# Altium schematic sheet SDRAM.SchDoc
size A3; Company Name: Renesas Electronics America; CompanyURL: www.renesas.com; PageSetup: Record=PageOptions|CenterHorizontal=True|CenterVertical=True|PrintScale=1.00|XCorrection=1.00|YCorrection=1.00|PrintKind=1|BorderSize=5000000|LeftOffset=0|BottomOffset=0|Orientation=2|PaperLength=1000|PaperWidth=1000|Scale=100|PaperSource=7|PrintQuality=-4|MediaType=1|DitherType=10|PaperKind=A5 148x210mm|PrintScaleMode=1; ReleaseDate: 16.09.2025; Version: MP; SheetNumber: 17; SheetTotal: 18; VariantNumber: 0; DSheetNumber: 1
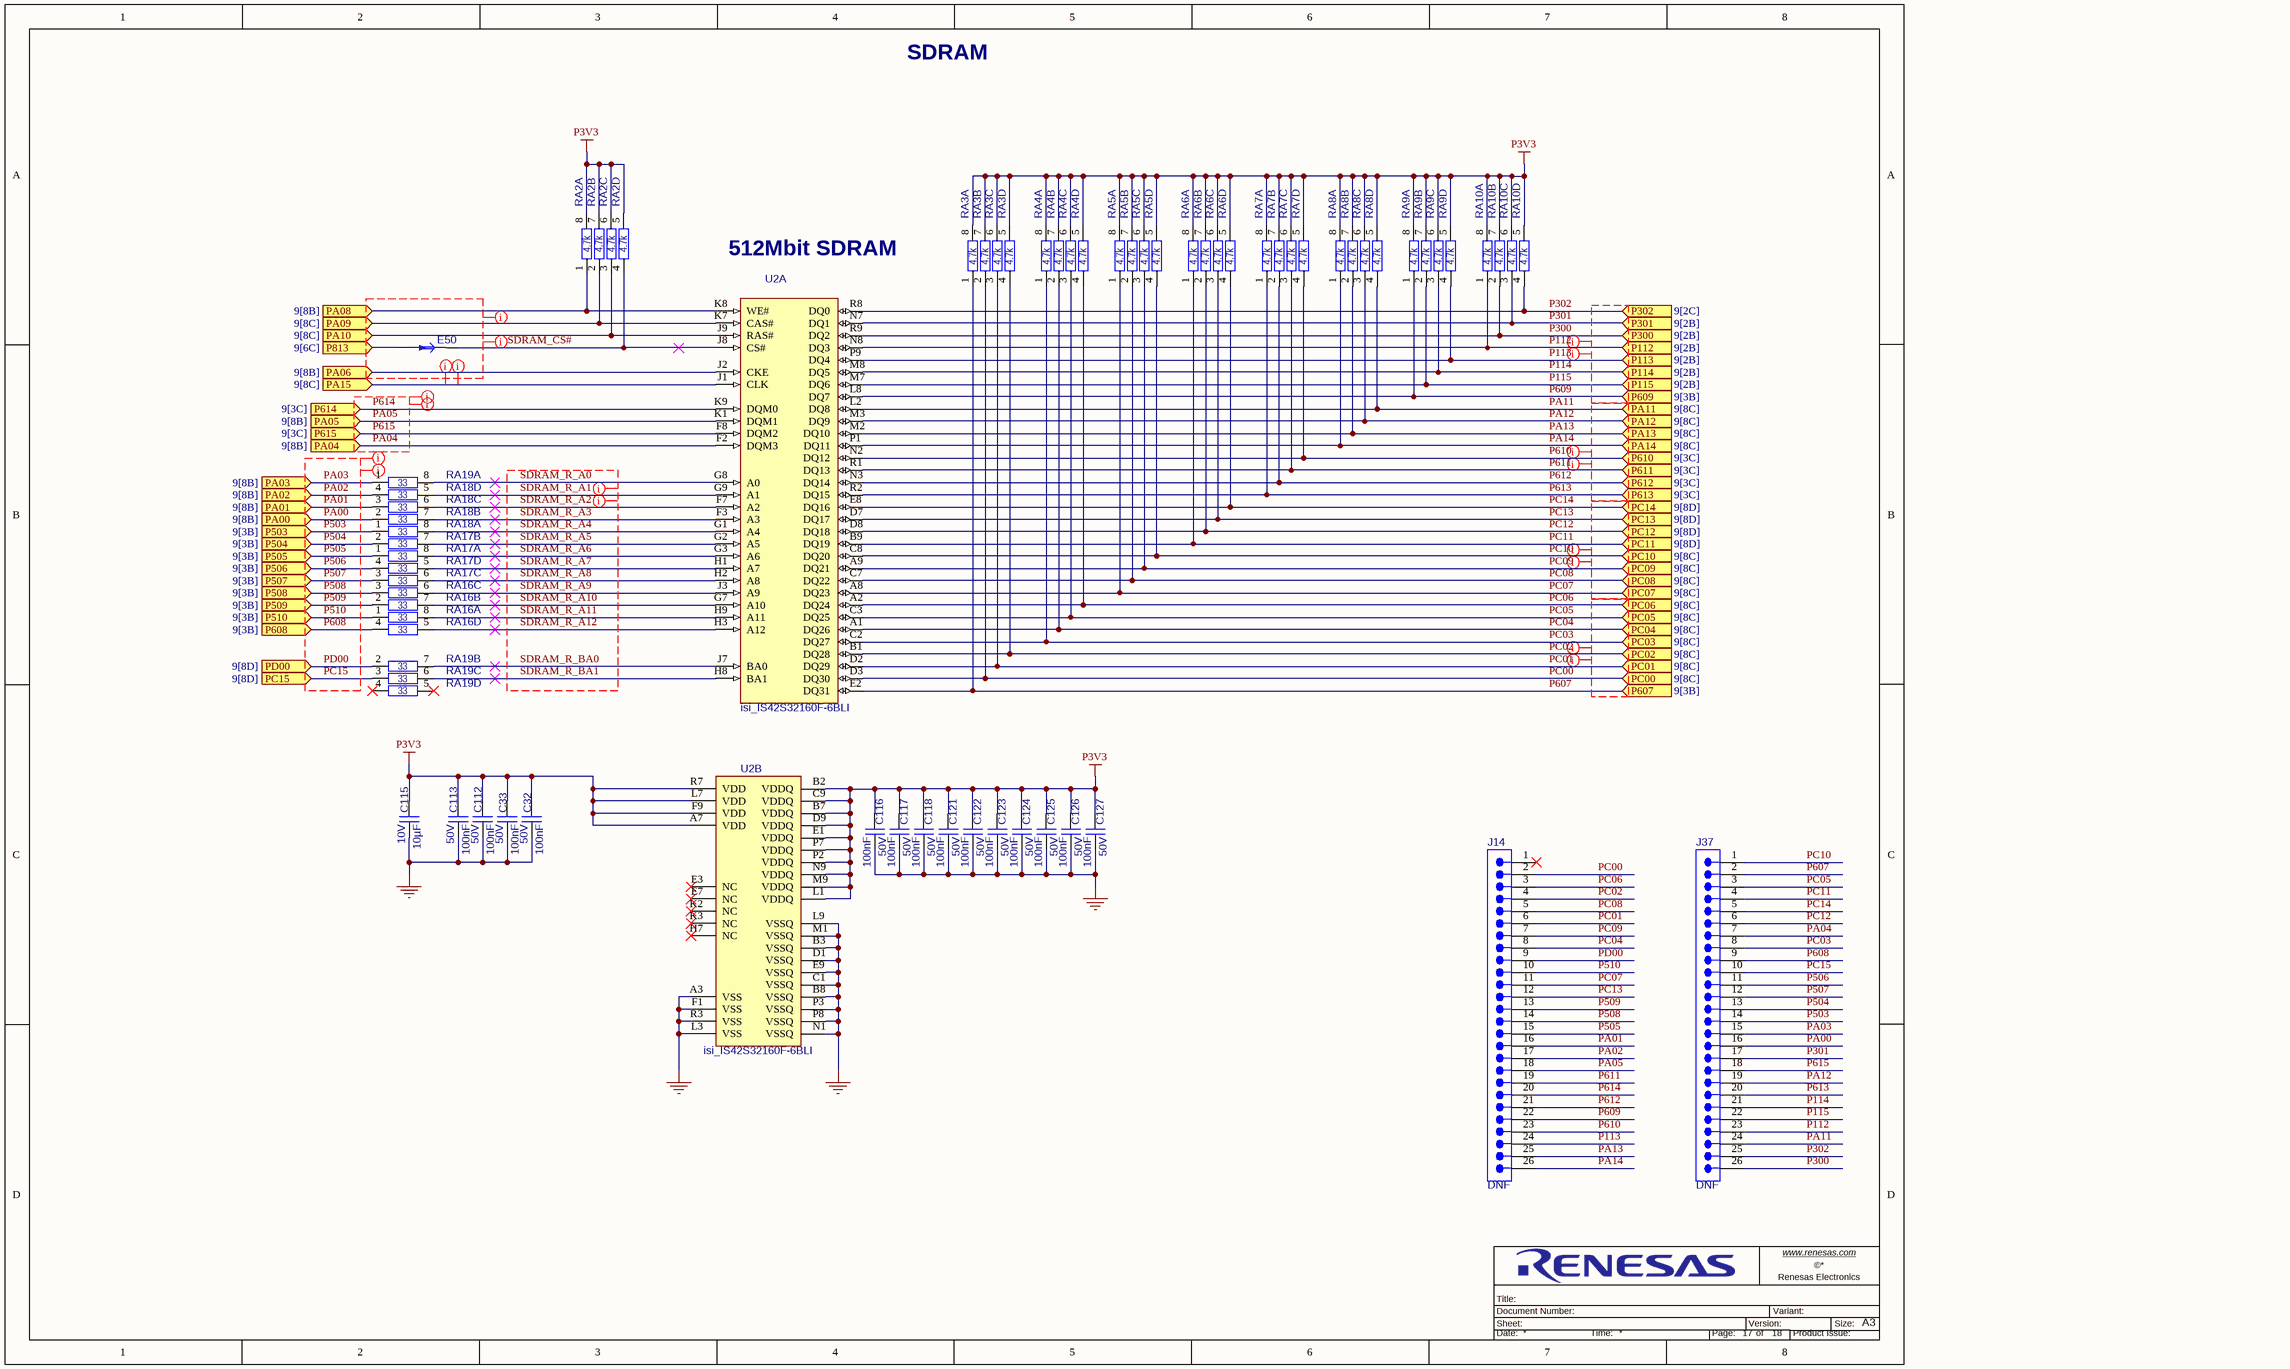
[diagram p0: SDRAM.SchDoc]

## Parts
C32  value 100nF  Operating Voltage Max: 50V  [C_EIA0402_0p55]  (hidden comment: Capacitor)
C33  value 100nF  Operating Voltage Max: 50V  [C_EIA0402_0p55]  (hidden comment: Capacitor)
C112  value 100nF  Operating Voltage Max: 50V  [C_EIA0402_0p55]  (hidden comment: Capacitor)
C113  value 100nF  Operating Voltage Max: 50V  [C_EIA0402_0p55]  (hidden comment: Capacitor)
C115  value 10µF  Operating Voltage Max: 10V  [C_EIA0402_0p7]  (hidden comment: Capacitor)
C116  value 100nF  Operating Voltage Max: 50V  [C_EIA0402_0p55]  (hidden comment: Capacitor)
C117  value 100nF  Operating Voltage Max: 50V  [C_EIA0402_0p55]  (hidden comment: Capacitor)
C118  value 100nF  Operating Voltage Max: 50V  [C_EIA0402_0p55]  (hidden comment: Capacitor)
C121  value 100nF  Operating Voltage Max: 50V  [C_EIA0402_0p55]  (hidden comment: Capacitor)
C122  value 100nF  Operating Voltage Max: 50V  [C_EIA0402_0p55]  (hidden comment: Capacitor)
C123  value 100nF  Operating Voltage Max: 50V  [C_EIA0402_0p55]  (hidden comment: Capacitor)
C124  value 100nF  Operating Voltage Max: 50V  [C_EIA0402_0p55]  (hidden comment: Capacitor)
C125  value 100nF  Operating Voltage Max: 50V  [C_EIA0402_0p55]  (hidden comment: Capacitor)
C126  value 100nF  Operating Voltage Max: 50V  [C_EIA0402_0p55]  (hidden comment: Capacitor)
C127  value 100nF  Operating Voltage Max: 50V  [C_EIA0402_0p55]  (hidden comment: Capacitor)
E50  TRACE_CUT_0805  [trace_cut_0805]  (value not drawn)  (net tie, no BOM)
J14  NRPN132PAEN-RC  [sul_NRPN132PAEN-RC]  (value not drawn)
J37  NRPN132PAEN-RC  [sul_NRPN132PAEN-RC]  (value not drawn)
RA2  value 4.7k  [R_Array_EIA0804]  (hidden comment: YC124-FR-074K7L)  (parts A,B,C,D of 4)
RA3  value 4.7k  [R_Array_EIA0804]  (hidden comment: Resistor_Array)  (parts A,B,C,D of 4)
RA4  value 4.7k  [R_Array_EIA0804]  (hidden comment: Resistor_Array)  (parts A,B,C,D of 4)
RA5  value 4.7k  [R_Array_EIA0804]  (hidden comment: Resistor_Array)  (parts A,B,C,D of 4)
RA6  value 4.7k  [R_Array_EIA0804]  (hidden comment: Resistor_Array)  (parts A,B,C,D of 4)
RA7  value 4.7k  [R_Array_EIA0804]  (hidden comment: Resistor_Array)  (parts A,B,C,D of 4)
RA8  value 4.7k  [R_Array_EIA0804]  (hidden comment: Resistor_Array)  (parts A,B,C,D of 4)
RA9  value 4.7k  [R_Array_EIA0804]  (hidden comment: Resistor_Array)  (parts A,B,C,D of 4)
RA10  value 4.7k  [R_Array_EIA0804]  (hidden comment: Resistor_Array)  (parts A,B,C,D of 4)
RA16  value 33  [R_Array_EIA0804]  (hidden comment: Resistor_Array)  (parts A,B,C,D of 4)
RA17  value 33  [R_Array_EIA0804]  (hidden comment: Resistor_Array)  (parts A,B,C,D of 4)
RA18  value 33  [R_Array_EIA0804]  (hidden comment: Resistor_Array)  (parts A,B,C,D of 4)
RA19  value 33  [R_Array_EIA0804]  (hidden comment: Resistor_Array)  (parts A,B,C,D of 4)
U2  isi_IS42S32160F-6BLI  [isi_TF-BGA-90_8x13mm]  (parts A,B of 2)

## Ports
P112 (in, see 9[2B]), P113 (in, see 9[2B]), P114 (in, see 9[2B]), P115 (in, see 9[2B]), P300 (in, see 9[2B]), P301 (in, see 9[2B]), P302 (in, see 9[2C]), P503 (in, see 9[3B]), P504 (in, see 9[3B]), P505 (in, see 9[3B]), P506 (in, see 9[3B]), P507 (in, see 9[3B]), P508 (in, see 9[3B]), P509 (in, see 9[3B]), P510 (in, see 9[3B]), P607 (in, see 9[3B]), P608 (in, see 9[3B]), P609 (in, see 9[3B]), P610 (in, see 9[3C]), P611 (in, see 9[3C]), P612 (in, see 9[3C]), P613 (in, see 9[3C]), P614 (in, see 9[3C]), P615 (in, see 9[3C]), P813 (in, see 9[6C]), PA00 (in, see 9[8B]), PA01 (in, see 9[8B]), PA02 (in, see 9[8B]), PA03 (in, see 9[8B]), PA04 (in, see 9[8B]), PA05 (in, see 9[8B]), PA06 (in, see 9[8B]), PA08 (in, see 9[8B]), PA09 (in, see 9[8C]), PA10 (in, see 9[8C]), PA11 (in, see 9[8C]), PA12 (in, see 9[8C]), PA13 (in, see 9[8C]), PA14 (in, see 9[8C]), PA15 (in, see 9[8C]), PC00 (in, see 9[8C]), PC01 (in, see 9[8C]), PC02 (in, see 9[8C]), PC03 (in, see 9[8C]), PC04 (in, see 9[8C]), PC05 (in, see 9[8C]), PC06 (in, see 9[8C]), PC07 (in, see 9[8C]), PC08 (in, see 9[8C]), PC09 (in, see 9[8C]), PC10 (in, see 9[8C]), PC11 (in, see 9[8D]), PC12 (in, see 9[8D]), PC13 (in, see 9[8D]), PC14 (in, see 9[8D]), PC15 (in, see 9[8D]), PD00 (in, see 9[8D])

## Nets
GND: C32.2 C33.2 C112.2 C113.2 C115.2 C116.2 C117.2 C118.2 C121.2 C122.2 C123.2 C124.2 C125.2 C126.2 C127.2 U2.A3(VSS) U2.B3(VSSQ) U2.B8(VSSQ) U2.C1(VSSQ) U2.D1(VSSQ) U2.E9(VSSQ) U2.F1(VSS) U2.L3(VSS) U2.L9(VSSQ) U2.M1(VSSQ) U2.N1(VSSQ) U2.P3(VSSQ) U2.P8(VSSQ) U2.R3(VSS)
P3V3: C32.1 C33.1 C112.1 C113.1 C115.1 C116.1 C117.1 C118.1 C121.1 C122.1 C123.1 C124.1 C125.1 C126.1 C127.1 RA2.5 RA2.6 RA2.7 RA2.8 RA3.5 RA3.6 RA3.7 RA3.8 RA4.5 RA4.6 RA4.7 RA4.8 RA5.5 RA5.6 RA5.7 RA5.8 RA6.5 RA6.6 RA6.7 RA6.8 RA7.5 RA7.6 RA7.7 RA7.8 RA8.5 RA8.6 RA8.7 RA8.8 RA9.5 RA9.6 RA9.7 RA9.8 RA10.5 RA10.6 RA10.7 RA10.8 U2.A7(VDD) U2.B2(VDDQ) U2.B7(VDDQ) U2.C9(VDDQ) U2.D9(VDDQ) U2.E1(VDDQ) U2.F9(VDD) U2.L1(VDDQ) U2.L7(VDD) U2.M9(VDDQ) U2.N9(VDDQ) U2.P2(VDDQ) U2.P7(VDDQ) U2.R7(VDD)
P112: J37.23 RA10.1 U2.N8(DQ3) ; port P112
P113: J14.24 RA9.4 U2.P9(DQ4) ; port P113
P114: J37.21 RA9.3 U2.M8(DQ5) ; port P114
P115: J37.22 RA9.2 U2.M7(DQ6) ; port P115
P300: J37.26 RA10.2 U2.R9(DQ2) ; port P300
P301: J37.17 RA10.3 U2.N7(DQ1) ; port P301
P302: J37.25 RA10.4 U2.R8(DQ0) ; port P302
P503: J37.14 RA18.1 ; port P503
P504: J37.13 RA17.2 ; port P504
P505: J14.15 RA17.1 ; port P505
P506: J37.11 RA17.4 ; port P506
P507: J37.12 RA17.3 ; port P507
P508: J14.14 RA16.3 ; port P508
P509: J14.13 RA16.2 ; port P509
P510: J14.10 RA16.1 ; port P510
P607: J37.2 RA3.1 U2.E2(DQ31) ; port P607
P608: J37.9 RA16.4 ; port P608
P609: J14.22 RA9.1 U2.L8(DQ7) ; port P609
P610: J14.23 RA7.4 U2.N2(DQ12) ; port P610
P611: J14.19 RA7.3 U2.R1(DQ13) ; port P611
P612: J14.21 RA7.2 U2.N3(DQ14) ; port P612
P613: J37.20 RA7.1 U2.R2(DQ15) ; port P613
P614: J14.20 U2.K9(DQM0) ; port P614
P615: J37.18 U2.F8(DQM2) ; port P615
P813: E50.2 ; port P813
PA00: J37.16 RA18.2 ; port PA00
PA01: J14.16 RA18.3 ; port PA01
PA02: J14.17 RA18.4 ; port PA02
PA03: J37.15 RA19.1 ; port PA03
PA04: J37.7 U2.F2(DQM3) ; port PA04
PA05: J14.18 U2.K1(DQM1) ; port PA05
PA06: U2.J2(CKE) ; port PA06
PA08: RA2.1 U2.K8(WE#) ; port PA08
PA09: RA2.2 U2.K7(CAS#) ; port PA09
PA10: RA2.3 U2.J9(RAS#) ; port PA10
PA11: J37.24 RA8.4 U2.L2(DQ8) ; port PA11
PA12: J37.19 RA8.3 U2.M3(DQ9) ; port PA12
PA13: J14.25 RA8.2 U2.M2(DQ10) ; port PA13
PA14: J14.26 RA8.1 U2.P1(DQ11) ; port PA14
PA15: U2.J1(CLK) ; port PA15
PC00: J14.2 RA3.2 U2.D3(DQ30) ; port PC00
PC01: J14.6 RA3.3 U2.D2(DQ29) ; port PC01
PC02: J14.4 RA3.4 U2.B1(DQ28) ; port PC02
PC03: J37.8 RA4.1 U2.C2(DQ27) ; port PC03
PC04: J14.8 RA4.2 U2.A1(DQ26) ; port PC04
PC05: J37.3 RA4.3 U2.C3(DQ25) ; port PC05
PC06: J14.3 RA4.4 U2.A2(DQ24) ; port PC06
PC07: J14.11 RA5.1 U2.A8(DQ23) ; port PC07
PC08: J14.5 RA5.2 U2.C7(DQ22) ; port PC08
PC09: J14.7 RA5.3 U2.A9(DQ21) ; port PC09
PC10: J37.1 RA5.4 U2.C8(DQ20) ; port PC10
PC11: J37.4 RA6.1 U2.B9(DQ19) ; port PC11
PC12: J37.6 RA6.2 U2.D8(DQ18) ; port PC12
PC13: J14.12 RA6.3 U2.D7(DQ17) ; port PC13
PC14: J37.5 RA6.4 U2.E8(DQ16) ; port PC14
PC15: J37.10 RA19.3 ; port PC15
PD00: J14.9 RA19.2 ; port PD00
SDRAM_CS#: E50.1 RA2.4 U2.J8(CS#)
SDRAM_R_A0: RA19.8 U2.G8(A0)
SDRAM_R_A1: RA18.5 U2.G9(A1)
SDRAM_R_A2: RA18.6 U2.F7(A2)
SDRAM_R_A3: RA18.7 U2.F3(A3)
SDRAM_R_A4: RA18.8 U2.G1(A4)
SDRAM_R_A5: RA17.7 U2.G2(A5)
SDRAM_R_A6: RA17.8 U2.G3(A6)
SDRAM_R_A7: RA17.5 U2.H1(A7)
SDRAM_R_A8: RA17.6 U2.H2(A8)
SDRAM_R_A9: RA16.6 U2.J3(A9)
SDRAM_R_A10: RA16.7 U2.G7(A10)
SDRAM_R_A11: RA16.8 U2.H9(A11)
SDRAM_R_A12: RA16.5 U2.H3(A12)
SDRAM_R_BA0: RA19.7 U2.J7(BA0)
SDRAM_R_BA1: RA19.6 U2.H8(BA1)

Not connected (* = marked no-connect by the designer): J14 1*; RA19 4* 5*; U2 E3(NC)* E7(NC)* H7(NC)* K2(NC)* K3(NC)*

## Layout directives
net class SDRAM_CONTROL: (no net found under the mark)
net class SDRAM_CLOCK: PA15
net class SDRAM_ADDRESS: P503, P504, P505, P506, P507, P508, P509, P510, P608, PA00, PA01, PA02, PA03, PC15, PD00, SDRAM_R_A0, SDRAM_R_A1, SDRAM_R_A2, SDRAM_R_A3, SDRAM_R_A4, SDRAM_R_A5, SDRAM_R_A6, SDRAM_R_A7, SDRAM_R_A8, SDRAM_R_A9, SDRAM_R_A10, SDRAM_R_A11, SDRAM_R_A12, SDRAM_R_BA0, SDRAM_R_BA1
net class SDRAM_DQM: P614, P615, PA04, PA05
net class SDRAM: (no net found under the mark), P503, P504, P505, P506, P507, P508, P509, P510, P608, P614, P615, PA00, PA01, PA02, PA03, PA04, PA05, PA15, PC15, PD00, SDRAM_R_A0, SDRAM_R_A1, SDRAM_R_A2, SDRAM_R_A3, SDRAM_R_A4, SDRAM_R_A5, SDRAM_R_A6, SDRAM_R_A7, SDRAM_R_A8, SDRAM_R_A9, SDRAM_R_A10, SDRAM_R_A11, SDRAM_R_A12, SDRAM_R_BA0, SDRAM_R_BA1
net class SDRAM_DATA_0: (no net found under the mark)
net class SDRAM_DATA_1: (no net found under the mark)
net class SDRAM_DATA_2: (no net found under the mark)
net class SDRAM_DATA_3: (no net found under the mark)

## Notes on the sheet
- SDRAM
- 512Mbit SDRAM
- www.renesas.com <http://www.renesas.com>
- Sheet:
- Title:
- Document Number:
- Version:
- Variant:
- Renesas Electronics
- Size:
- A3
- Date:
- Time:
- Page:
- of
- Product Issue:

## Library data of the parts
C32 C33 C112 C113 C116-C118 C121-C127 = CAP-00003203-9: Capacitor,EIA0402,100n,50V,X7R; Tolerance: 10%; Qualification: AEC-Q200; Subtype: MLCC; Dielectric: X7R; Height: 550µm; Operating Temperature Max: 125°C; Operating Temperature Min: -55°C
C115 = CAP-00003447-8: Capacitor,EIA0402,10u,10V,X5R; Tolerance: 20%; Subtype: MLCC; Dielectric: X5R; Height: 700µm; Operating Temperature Max: 85°C; Operating Temperature Min: -55°C; Qualification: -
E50 = MIS-00000000-11: Trace Cut, SMD, 0805 size; Value: TC; Pin Count: 2; Qualification: -; Subtype: Trace Cut
J14 J37 = CON-00000094-5: Header,26way,2row,vertical,2.00mm,THT; Operating Voltage Max: 150V; DC Resistance: 20m; Gender: male; Current: 2A; Pin Count: 26; Operating Temperature Max: 105°C; Operating Temperature Min: -40°C; Qualification: -; Height: 8.8mm; DNF: DNF
RA2-RA10 = RES-00003456-16: Resistor Network & Array,0804,4.7k,0.0625W; Power: 62.5mW; Tolerance: 1%; Qualification: AEC-Q200; Subtype: Resistor Array; Temperature Coefficient: 200ppm; Operating Temperature Max: 155°C; Operating Temperature Min: -55°C
RA16-RA19 = RES-00003457-16: Resistor Network & Array,0804,33,0.0625W; Power: 62.5mW; Tolerance: 1%; Qualification: AEC-Q200; Subtype: Resistor Array; Temperature Coefficient: 200ppm; Operating Temperature Max: 155°C; Operating Temperature Min: -55°C
U2 = ICS-00000024-8: 512Mb Synchronous DRAM, 16MX32, 5.4ns, CMOS, TF-BGA90; Operating Voltage Max: 3.6V; Operating Voltage Min: 2.3V; Subtype: Digital; Operating Temperature Max: 85°C; Operating Temperature Min: -40°C; Pin Count: 90; Qualification: -